# EAGLE design shift_driver (EAGLE 8.3.2)
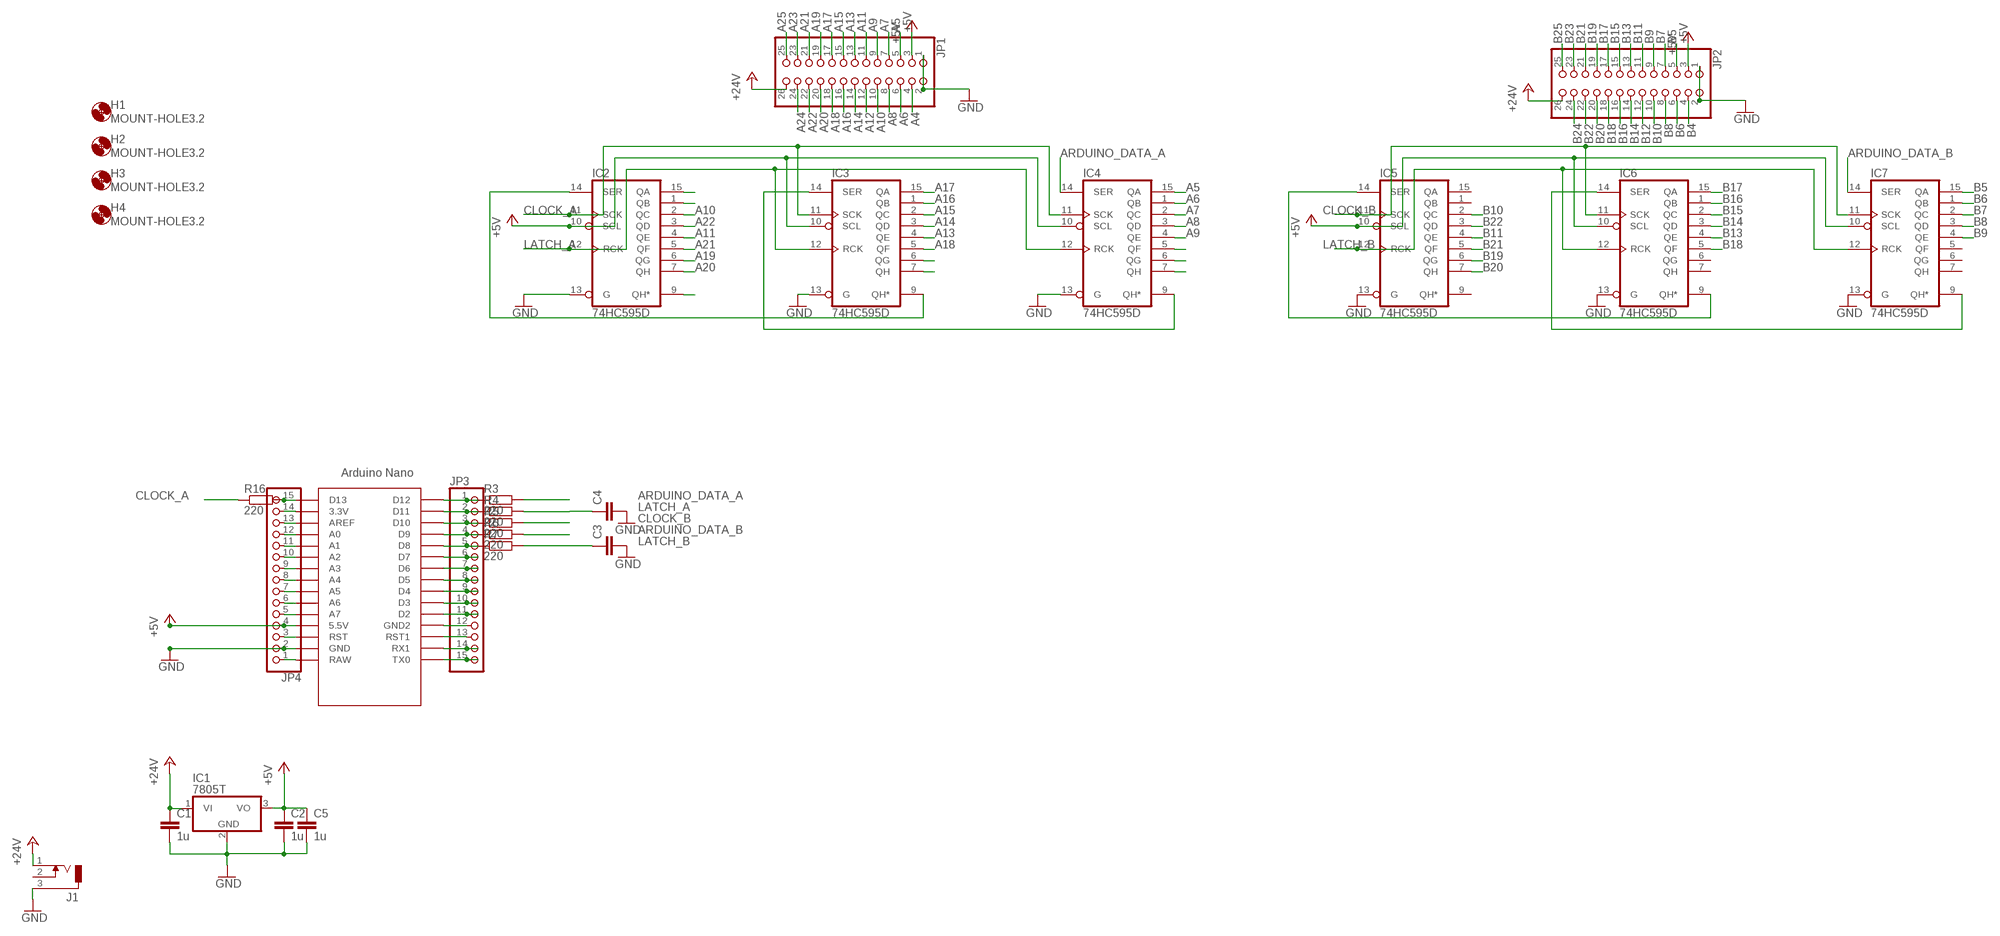
[diagram p0: schematic, sheet 1]

## Parts
C1  1u  C-EUC0805  [C0805]
C2  1u  C-EUC0805  [C0805]
C3  C-EUC0805  [C0805]
C4  C-EUC0805  [C0805]
C5  1u  C-EUC0805  [C0805]
H1  MOUNT-HOLE3.2  [3,2]
H2  MOUNT-HOLE3.2  [3,2]
H3  MOUNT-HOLE3.2  [3,2]
H4  MOUNT-HOLE3.2  [3,2]
IC1  7805T  [TO220H]
IC2  74HC595D  [SO16]
IC3  74HC595D  [SO16]
IC4  74HC595D  [SO16]
IC5  74HC595D  [SO16]
IC6  74HC595D  [SO16]
IC7  74HC595D  [SO16]
J1  DCJ0303  [DCJ0303]
JP1  PINHD-2X13  [2X13]
JP2  PINHD-2X13  [2X13]
JP3  PINHD-1X15  [1X15]
JP4  PINHD-1X15  [1X15]
R3  220  R-EU_R0603  [R0603]
R4  220  R-EU_R0603  [R0603]
R5  220  R-EU_R0603  [R0603]
R6  220  R-EU_R0603  [R0603]
R7  220  R-EU_R0603  [R0603]
R16  220  R-EU_R0603  [R0603]
U$1  NANO  [NANO]

## Nets
+5V: C2.1 C5.1 IC1.3(VO) IC2.10(SCL) IC3.10(SCL) IC4.10(SCL) IC5.10(SCL) IC6.10(SCL) IC7.10(SCL) JP1.3 JP2.3 JP4.4 U$1.5V(5.5V)
+24V: C1.1 IC1.1(VI) J1.1 JP1.26 JP2.26
A4: JP1.4
A5: IC4.15(QA) JP1.5
A6: IC4.1(QB) JP1.6
A7: IC4.2(QC) JP1.7
A8: IC4.3(QD) JP1.8
A9: IC4.4(QE) JP1.9
A10: IC2.2(QC) JP1.10
A11: IC2.4(QE) JP1.11
A12: JP1.12
A13: IC3.4(QE) JP1.13
A14: IC3.3(QD) JP1.14
A15: IC3.2(QC) JP1.15
A16: IC3.1(QB) JP1.16
A17: IC3.15(QA) JP1.17
A18: IC3.5(QF) JP1.18
A19: IC2.6(QG) JP1.19
A20: IC2.7(QH) JP1.20
A21: IC2.5(QF) JP1.21
A22: IC2.3(QD) JP1.22
A23: JP1.23
A24: JP1.24
A25: JP1.25
ARDUINO_DATA_A: IC4.14(SER) R3.2
ARDUINO_DATA_B: IC7.14(SER) R6.2
B4: JP2.4
B5: IC7.15(QA) JP2.5
B6: IC7.1(QB) JP2.6
B7: IC7.2(QC) JP2.7
B8: IC7.3(QD) JP2.8
B9: IC7.4(QE) JP2.9
B10: IC5.2(QC) JP2.10
B11: IC5.4(QE) JP2.11
B12: JP2.12
B13: IC6.4(QE) JP2.13
B14: IC6.3(QD) JP2.14
B15: IC6.2(QC) JP2.15
B16: IC6.1(QB) JP2.16
B17: IC6.15(QA) JP2.17
B18: IC6.5(QF) JP2.18
B19: IC5.6(QG) JP2.19
B20: IC5.7(QH) JP2.20
B21: IC5.5(QF) JP2.21
B22: IC5.3(QD) JP2.22
B23: JP2.23
B24: JP2.24
B25: JP2.25
CLOCK_A: IC2.11(SCK) IC3.11(SCK) IC4.11(SCK) R16.1
CLOCK_B: IC5.11(SCK) IC6.11(SCK) IC7.11(SCK) R5.2
GND: C1.2 C2.2 C3.2 C4.2 C5.2 IC1.2(GND) IC2.13(G) IC3.13(G) IC4.13(G) IC5.13(G) IC6.13(G) IC7.13(G) J1.3 JP1.1 JP1.2 JP2.1 JP2.2 JP4.2 U$1.GND
LATCH_A: C4.1 IC2.12(RCK) IC3.12(RCK) IC4.12(RCK) R4.2
LATCH_B: C3.1 IC5.12(RCK) IC6.12(RCK) IC7.12(RCK) R7.2
N$6: IC2.15(QA)
N$8: IC2.14(SER) IC3.9(QH*)
N$9: JP3.12 U$1.GND1(GND2)
N$12: JP3.13 U$1.RST1
N$13: IC2.1(QB)
N$14: IC3.14(SER) IC4.9(QH*)
N$15: JP4.1 U$1.RAW
N$16: JP4.3 U$1.RST
N$25: JP4.13 U$1.AREF
N$26: JP4.14 U$1.3.3V
N$32: JP3.15 U$1.TX0
N$33: JP3.14 U$1.RX1
N$34: JP3.11 U$1.D2
N$35: JP3.10 U$1.D3
N$36: JP3.9 U$1.D4
N$37: JP3.8 U$1.D5
N$38: JP3.7 U$1.D6
N$39: JP3.6 U$1.D7
N$40: JP3.5 R7.1 U$1.D8
N$41: JP3.4 R6.1 U$1.D9
N$42: JP3.3 R5.1 U$1.D10
N$43: JP3.2 R4.1 U$1.D11
N$44: JP3.1 R3.1 U$1.D12
N$46: JP4.15 R16.2 U$1.D13
N$47: JP4.12 U$1.A0
N$48: JP4.11 U$1.A1
N$49: JP4.10 U$1.A2
N$50: JP4.9 U$1.A3
N$51: JP4.8 U$1.A4
N$52: JP4.7 U$1.A5
N$53: JP4.6 U$1.A6
N$54: JP4.5 U$1.A7
N$57: IC2.9(QH*)
N$64: IC3.6(QG)
N$65: IC3.7(QH)
N$71: IC4.5(QF)
N$72: IC4.6(QG)
N$73: IC4.7(QH)
N$77: IC5.14(SER) IC6.9(QH*)
N$78: IC6.14(SER) IC7.9(QH*)
Unconnected: IC5.1(QB) IC5.9(QH*) IC5.15(QA) IC6.6(QG) IC6.7(QH) IC7.5(QF) IC7.6(QG) IC7.7(QH) J1.2 U$1.ICSP1 U$1.ICSP2 U$1.ICSP3 U$1.ICSP4 U$1.ICSP5 U$1.ICSP6

## Power pins joined to a net without a drawn wire
GND: IC2.8(GND) IC3.8(GND) IC4.8(GND) IC5.8(GND) IC6.8(GND) IC7.8(GND)
VCC: IC2.16(VCC) IC3.16(VCC) IC4.16(VCC) IC5.16(VCC) IC6.16(VCC) IC7.16(VCC)

## Library data of the parts
C1-C5 = rcl:C-EU: CAPACITOR, European symbol
H1-H4 = holes:MOUNT-HOLE: MOUNTING HOLE with drill center marker
IC1 = linear:78*: Positive VOLTAGE REGULATOR Source: http://cache.national.com/ds/LM/LM78L05.pdf http://www.fairchildsemi.com/ds/LM/LM7805.pdf
IC2-IC7 = 74xx-eu:74*595: 8-bit SHIFT REGISTER, output latch
J1 = AH_components:DCJ0303: DC POWER JACK Source: DCJ0303.pdf; OC_FARNELL: unknown; OC_NEWARK: unknown
JP1 JP2 = pinhead:PINHD-2X13: PIN HEADER
JP3 JP4 = pinhead:PINHD-1X15: PIN HEADER
R3-R7 R16 = rcl:R-EU_: RESISTOR, European symbol
U$1 = Arduino-clone:NANO: Arduino Nano

## Net classes
0 default: clearance 0.205 mm

## Board
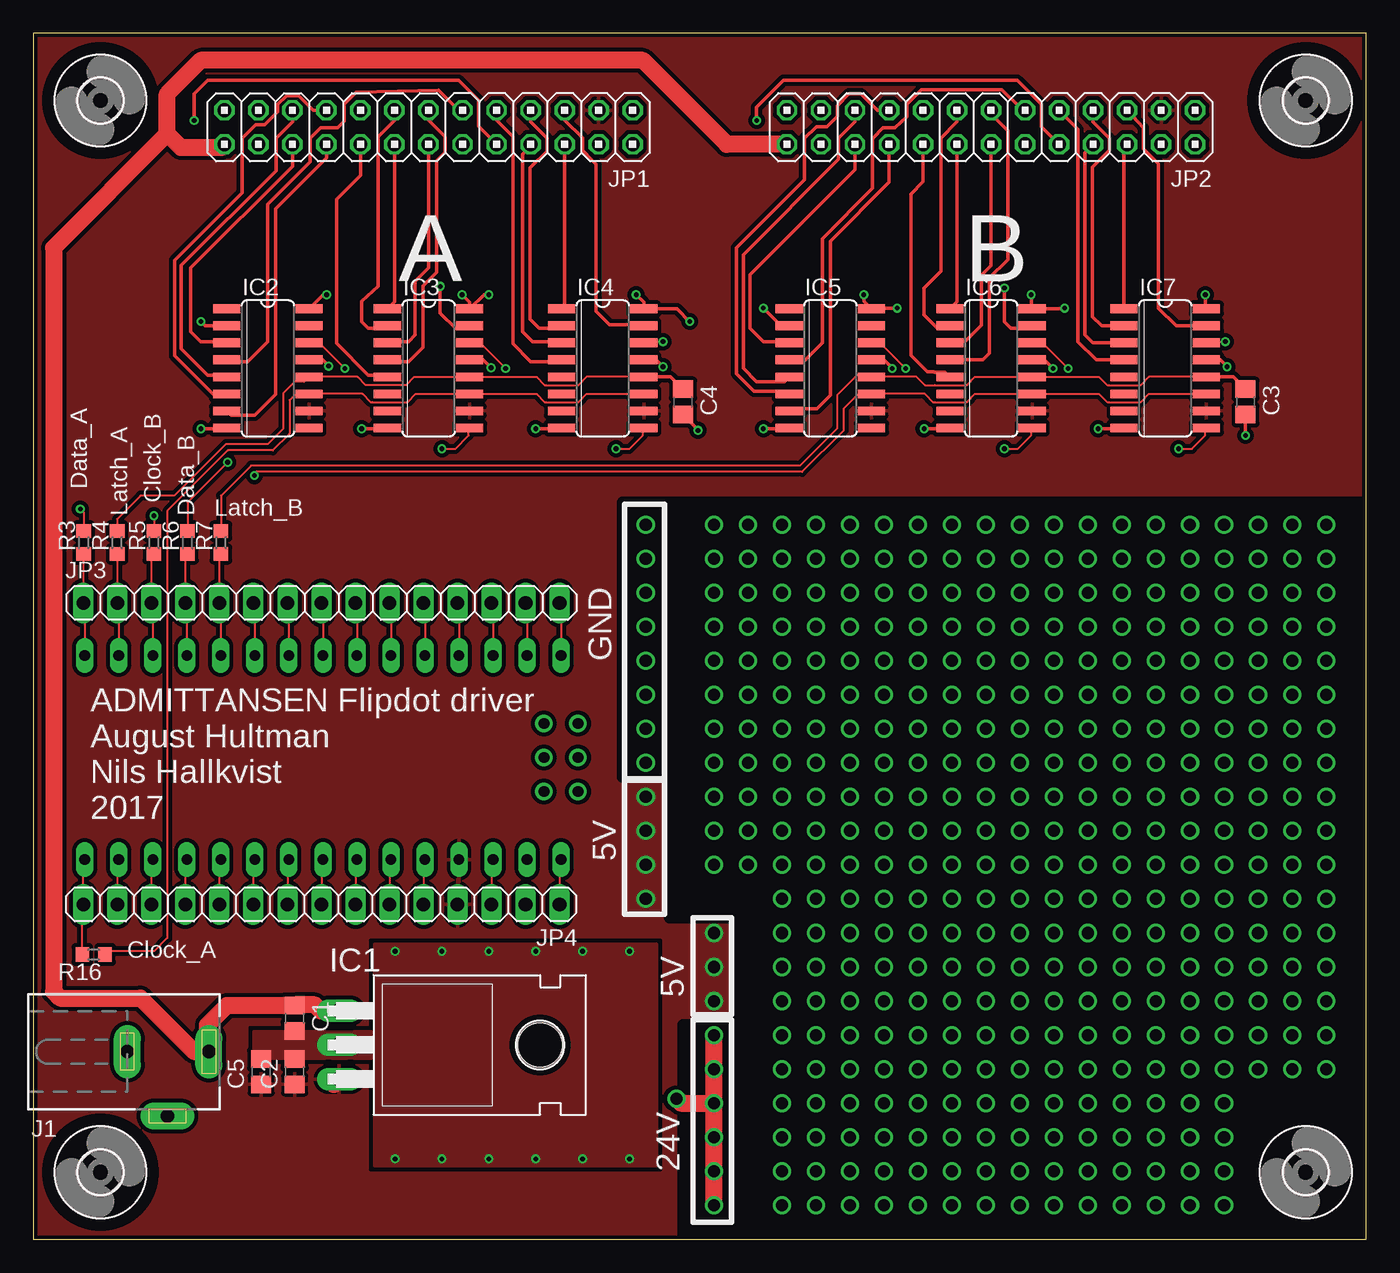
[diagram p1: board, top side]
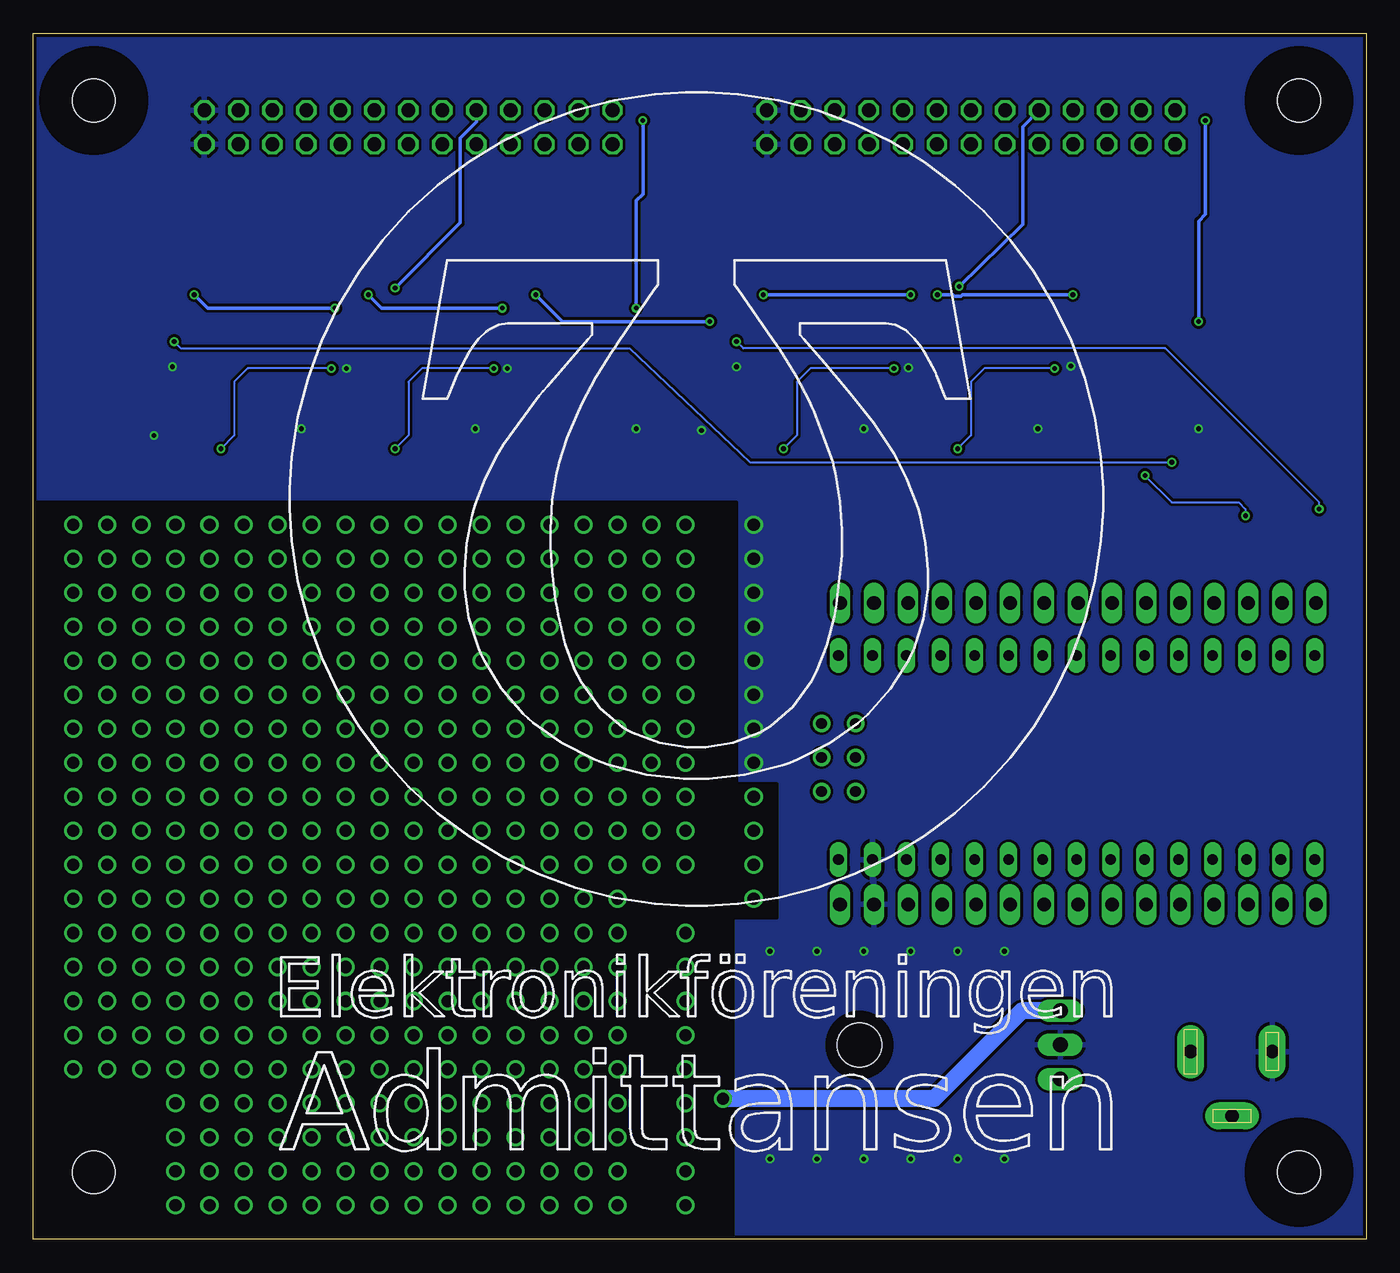
[diagram p2: board, bottom side, seen from below]

Size 99.5 x 90 mm. Coordinates in mm from the lower left corner, seen from the top.
Outline: 0,0 99.5,0 99.5,90 0,90 0,0
Copper layers (1*16): Top 0.035mm / dielectric 1.5mm / Bottom 0.035mm
Design rules "SeeedStudio_2layer_DRU_no_angle_20140221 *": minimum track width 6mil, minimum drill 12mil, track to track 6mil, track to pad 6mil, pad to pad 6mil, via to via 6mil, smd to smd 0mil, copper to edge 10mil, drill to drill 10mil, minimum pad ring 10mil, minimum via ring 6mil, stop-mask expansion 2mil, vias tented up to drill 100mil, thermal gap 10mil
tRestrict: area 44,0 to 99.5,55
bRestrict: area 44,0 to 99.5,55

### Footprints (pad centres in the part's own frame; a part is rotated, then mirrored left to right if it is on the bottom)
C0805 = smd 1.3 x 1.5: 1 -0.95,0; 2 0.95,0
3,2 = hole 3.2: 0,0
TO220H = drill 1.118 long: 1 -2.54,-10.16; 2 0,-10.16; 3 2.54,-10.16 | hole 3.302: 0,4.826
SO16 = smd 0.66 x 2.032: 1 -4.445,-3.073; 2 -3.175,-3.073; 3 -1.905,-3.073; 4 -0.635,-3.073; 5 0.635,-3.073; 6 1.905,-3.073; 7 3.175,-3.073; 8 4.445,-3.073; 9 4.445,3.073; 10 3.175,3.073; 11 1.905,3.073; 12 0.635,3.073; 13 -0.635,3.073; 14 -1.905,3.073; 15 -3.175,3.073; 16 -4.445,3.073
DCJ0303 = drill 1 pad 2 long: 1 0,3.1; 2 4.8,0; 3 0,-3
2X13 = drill 1.016 octagon: 1 -15.24,-1.27; 2 -15.24,1.27; 3 -12.7,-1.27; 4 -12.7,1.27; 5 -10.16,-1.27; 6 -10.16,1.27; 7 -7.62,-1.27; 8 -7.62,1.27; 9 -5.08,-1.27; 10 -5.08,1.27; 11 -2.54,-1.27; 12 -2.54,1.27; 13 0,-1.27; 14 0,1.27; 15 2.54,-1.27; 16 2.54,1.27; 17 5.08,-1.27; 18 5.08,1.27; 19 7.62,-1.27; 20 7.62,1.27; 21 10.16,-1.27; 22 10.16,1.27; 23 12.7,-1.27; 24 12.7,1.27; 25 15.24,-1.27; 26 15.24,1.27
1X15 = drill 1.016 long: 1 -17.78,0; 2 -15.24,0; 3 -12.7,0; 4 -10.16,0; 5 -7.62,0; 6 -5.08,0; 7 -2.54,0; 8 0,0; 9 2.54,0; 10 5.08,0; 11 7.62,0; 12 10.16,0; 13 12.7,0; 14 15.24,0; 15 17.78,0
R0603 = smd 1 x 1.1: 1 -0.85,0; 2 0.85,0
NANO = drill 0.8 long: 3.3V -10.16,24.13; 5V -10.16,-1.27; A0 -10.16,19.05; A1 -10.16,16.51; A2 -10.16,13.97; A3 -10.16,11.43; A4 -10.16,8.89; A5 -10.16,6.35; A6 -10.16,3.81; A7 -10.16,1.27; AREF -10.16,21.59; D2 5.08,1.27; D3 5.08,3.81; D4 5.08,6.35; D5 5.08,8.89; D6 5.08,11.43; D7 5.08,13.97; D8 5.08,16.51; D9 5.08,19.05; D10 5.08,21.59; D11 5.08,24.13; D12 5.08,26.67; D13 -10.16,26.67; GND -10.16,-6.35; GND1 5.08,-1.27; RAW -10.16,-8.89; RST -10.16,-3.81; RST1 5.08,-3.81; RX1 5.08,-6.35; TX0 5.08,-8.89 | drill 0.8: ICSP1 -5.08,-10.16; ICSP2 -5.08,-7.62; ICSP3 -2.54,-10.16; ICSP4 -2.54,-7.62; ICSP5 0,-10.16; ICSP6 0,-7.62

### Placement (x,y rotation side)
C1  19.5,16.5 270 top
C2  19.5,12.5 90 top
C3  90.5,62.5 270 top
C4  48.5,62.5 270 top
C5  17,12.5 90 top
H1  5,5 0 top
H2  5,85 0 top
H3  95,5 0 top
H4  95,85 0 top
IC1  33,14.5 270 top
IC2  17.5,65 270 top
IC3  29.5,65 270 top
IC4  42.5,65 270 top
IC5  59.5,65 270 top
IC6  71.5,65 270 top
IC7  84.5,65 270 top
J1  10,14 270 top
JP1  29.5,83 180 top
JP2  71.5,83 180 top
JP3  21.5,47.5 0 top
JP4  21.5,25 180 top
R3  3.75,52 90 top
R4  6.25,52 90 top
R5  9,52 90 top
R6  11.5,52 90 top
R7  14,52 90 top
R16  4.5,21.25 180 top
U$1  30.5,38.5 90 top

### Tracks (layer width: path | path; a pad name or v marks a point on that pad's centre or on a via)
+5V  (via drill 0.9)
  Top 1.27: 22.43,11.55 IC1.3
  other vias: 50.8,17.78 50.8,20.32 50.8,22.86 45.72,25.4 45.72,27.94 45.72,30.48 45.72,33.02
  pour Top (isolate 0.3, rank 3): 0,90 99.5,90 99.5,0 0,0
+24V  (via drill 0.9)
  Top 1.27: IC1.1 21.46,17.04 21,17.5 19.55,17.5 C1.1 14.45,17.45 13,16 13,14.1 J1.1 12,14 8,18 2,18 1.5,18.5 1.5,74 10,82.5 | JP2.26 51.77,81.73 45.5,88 12.5,88 10,85.5 10,82.5 | 10,82.5 11,81.5 14.03,81.5 JP1.26 | v48,10.5 48.34,10.16 v50.8,10.16 | v50.8,2.54 v50.8,5.08 v50.8,7.62 v50.8,10.16 | v50.8,10.16 v50.8,12.7 v50.8,15.24
  Bottom 1.27: IC1.1 25.71,17.04 32.25,10.5 v48,10.5
A5
  Top 0.254: JP1.5 39.66,83.53 40.98,82.2 40.98,81.28 41.75,80.51 41.86,80.39 42,80.25 42,69.25 43,68.25 45.5,68.25 IC4.15
A6
  Top 0.254: JP1.6 39.66,69.68 IC4.1
A7
  Top 0.254: JP1.7 37.12,83.4 38.34,82.18 38.34,81.21 37.09,79.96 37.09,68.66 37.75,68 39.25,68 IC4.2
A8
  Top 0.254: JP1.8 37.12,81.62 36.5,81 36.5,67.75 37.25,67 39.33,67 IC4.3
A9
  Top 0.254: JP1.9 34.58,83.53 35.8,82.31 35.8,66.83 37.12,65.5 39.29,65.5 IC4.4
A10  (via drill 0.35)
  Top 0.254: IC2.2 12.82,68.17 v12.5,68.5 | v12,83.5 12,85.5 13,86.5 31.75,86.5 33.25,85 33.25,83.06 JP1.10
  Bottom 0.254: v12.5,68.5 12.5,76 12,76.5 v12,83.5
A11
  Top 0.254: JP1.11 31.73,84.27 30.25,85.75 24.11,85.62 23.2,84.72 23.2,83.45 22.7,82.95 21.43,82.95 20.66,82.18 20.66,80.41 17.5,77.25 17.5,67 16,65.5 14.56,65.5 IC2.4
A13
  Top 0.254: JP1.13 29.5,83.53 30.72,82.31 30.72,81.15 30.08,80.52 30.08,72.19 29.08,71.19 29.08,66.58 28,65.5 26.56,65.5 IC3.4
A14
  Top 0.254: JP1.14 29.5,72.5 28.5,71.5 28.5,67.5 28,67 26.52,67 IC3.3
A15
  Top 0.254: JP1.15 26.96,83.53 25.74,82.31 25.74,71.12 24.5,70 24.5,68.5 25,68 26.25,68 IC3.2
A16
  Top 0.254: JP1.16 26.96,69.98 IC3.1
A17  (via drill 0.35)
  Top 0.254: IC3.15 32.4,68 31.5,68 30.38,69.12 v30.38,71.12
  Bottom 0.254: JP1.17 25.64,83.05 25.64,81.15 25.62,81.02 25.62,75.75 v30.38,71.12
A18
  Top 0.254: JP1.18 24.42,79.42 22.62,77.62 22.62,66.88 25,64.5 25.75,64.5 25.77,64.47 26.32,64.47 IC3.5
A19
  Top 0.254: 16.35,82.95 16.26,82.86 | 16.26,82.86 15.58,82.18 15.58,78.13 10.54,73.09 10.54,65.96 13.5,63 14.33,63 IC2.6 | 16.26,82.86 16.58,83.18 17.25,83.18 18.25,84.17 18.25,84.72 18.89,85.36 19.79,85.36 20.89,84.27 JP1.19
A20
  Top 0.254: JP1.20 21.88,80.73 18.07,76.93 18.07,63.07 16.5,61.5 14.75,61.5 IC2.7
A21
  Top 0.254: JP1.21 19.34,83.4 18.12,82.18 18.12,79.77 11.04,72.69 11.04,66.46 13,64.5 14.29,64.5 IC2.5
A22
  Top 0.254: JP1.22 19.34,80.09 11.75,72.5 11.75,67.75 12.5,67 14.33,67 IC2.3
ARDUINO_DATA_A  (via drill 0.35)
  Top 0.152: IC4.14 45.67,67 v47,67 | v3.5,54.5 3.75,54.25 R3.2
  Bottom 0.152: v47,67 46.5,66.5 15,66.5 3.5,55 v3.5,54.5
ARDUINO_DATA_B  (via drill 0.35)
  Top 0.152: IC7.14 87.67,67 v89,67 | v14.5,58 11.5,55 R6.2
  Bottom 0.152: v89,67 88.5,66.5 55,66.5 46,58 v14.5,58
B5
  Top 0.254: JP2.5 82.86,82.95 82.86,81.4 84,80.26 84,69.5 85.33,68.17 IC7.15
B6
  Top 0.254: JP2.6 81.43,81.5 IC7.1
B7
  Top 0.254: JP2.7 79.12,83.4 80.34,82.18 80.34,81.28 79.08,80.02 79.08,68.88 79.78,68.17 IC7.2
B8
  Top 0.254: JP2.8 78.5,81.11 78.5,67.5 79.09,66.91 IC7.3
B9
  Top 0.254: JP2.9 78,82.85 78,67 79.36,65.64 IC7.4
B10  (via drill 0.35)
  Top 0.254: JP2.10 75.26,83.05 75.26,84.72 73.48,86.5 56,86.5 54,84.5 v54,83.5 | v54.5,69.5 55.83,68.17 IC5.2
  Bottom 0.254: v54,83.5 54,78 54.5,77.5 v54.5,69.5
B11
  Top 0.254: 62.66,82.06 62.68,82.2 | 62.68,82.2 63.43,82.95 64.33,82.95 65.2,83.8 65.2,84.72 66.3,85.82 72.33,85.82 73.88,84.27 JP2.11 | 62.68,82.2 62.66,82.06 | 62.66,82.06 62.66,78.43 58.92,74.69 58.92,66.92 57.5,65.5 56.56,65.5 IC5.4
B13
  Top 0.254: JP2.13 71.5,84 72.75,82.75 72.75,73.12 71.38,71.75 71.38,66.12 70.89,65.64 IC6.4
B14
  Top 0.254: IC6.3 68.54,67.02 69.58,67.02 70.79,68.23 70.79,71.94 71.5,72.65 JP2.14
B15
  Top 0.254: JP2.15 68.96,83.4 67.74,82.18 67.74,72.24 66.5,71 66.5,69 67.5,68 68.25,68 IC6.2
B16
  Top 0.254: JP2.16 68.96,69.98 IC6.1
B17  (via drill 0.35)
  Top 0.254: IC6.15 74.4,68 73,68 72.5,68.5 v72.5,71
  Bottom 0.254: JP2.17 66.42,83.4 67.64,82.18 67.64,75.86 v72.5,71
B18
  Top 0.254: JP2.18 66.42,78.92 65.5,78 65.5,66 66.75,64.75 67.25,64.75 67.27,64.72 68.07,64.72 IC6.5
B19
  Top 0.254: JP2.19 63.01,84.27 61.79,85.49 60.89,85.49 60.02,84.62 60.02,83.82 59.25,83.05 58.45,83.05 57.58,82.18 57.58,79.08 52.5,74 52.5,64.6 53.81,63.29 56.23,63.29 IC5.6
B20
  Top 0.254: IC5.7 56.6,62 58.5,62 59.5,63 59.5,74.5 | JP2.20 63.88,78.88 59.5,74.5 | 59.5,74.5
B21
  Top 0.254: JP2.21 61.34,83.4 60.12,82.18 60.12,80.62 53,73.5 53,65 54,64 56.06,64 IC5.5
B22
  Top 0.254: JP2.22 61.34,79.84 53.5,72 53.5,68 54.5,67 56.33,67 IC5.3
CLOCK_A
  Top 0.152: IC4.11 41.29,63.09 40.68,62.48 40.56,62.48 38.29,62.48 38.17,62.48 37.56,63.09 IC3.11 28.54,63.09 27.93,62.48 27.56,62.48 25.29,62.48 25.17,62.48 24.56,63.09 IC2.11 20.48,63 19.5,63 19.12,62.62 19.12,60.12 17.88,58.88 14.5,58.88 10,54.38 10,22.5 9,21.5 5.6,21.5 R16.1
CLOCK_B  (via drill 0.35)
  Top 0.152: IC7.11 83.29,63.09 82.68,62.48 82.56,62.48 80.29,62.48 80.17,62.48 79.56,63.09 IC6.11 70.29,63.09 69.68,62.48 69.56,62.48 67.29,62.48 67.17,62.48 66.56,63.09 IC5.11 62.48,63 61.5,63 60.48,61.98 60.48,60.35 57.4,57.27 16.62,57.27 16.5,57.14 v16.5,57 | v9,54 R5.2
  Bottom 0.152: v16.5,57 14.5,55 9.5,55 9,54.5 v9,54
GND  (via drill 0.35, 0.9)
  Top 0.254: IC5.13 63.49,65.64 v64.12,65 | IC6.13 75.49,65.64 v76.12,65 | IC7.13 88.61,65.64 v89.12,65.12 | IC2.13 21.58,65.64 v22.04,65.17 | IC3.13 33.58,65.64 v34.17,65.05 | IC4.13 46.49,65.64 v47,65.12 | IC4.8 39.37,60.5 v37.5,60.5 | IC3.8 26.37,60.5 v24.5,60.5 | IC2.8 14.37,60.5 v12.5,60.5 | IC5.8 56.37,60.5 v54.5,60.5 | IC6.8 68.37,60.5 v66.5,60.5 | IC7.8 81.37,60.5 v79.5,60.5 | C3.2 v90.5,60 | C4.2 49.5,60.55 v49.62,60.38
  other vias: 27,21.5 30.5,21.5 34,21.5 37.5,21.5 41,21.5 44.5,21.5 27,6 30.5,6 34,6 37.5,6 41,6 44.5,6 45.72,53.34 45.72,50.8 45.72,48.26 45.72,45.72 45.72,43.18 45.72,40.64 45.72,38.1 45.72,35.56
  pour Bottom (isolate 0.6, rank 2): 0,90 0,0 99.5,0 99.5,90
  pour Top (isolate 0.61, rank 2, no thermals): 46.5,22 46.5,5.5 25.5,5.5 25.5,13.5 16.5,13.5 16.5,15.5 25.5,15.5 25.5,22
  pour Bottom: 0,0 0,90 99.5,90 99.5,0
LATCH_A
  Top 0.152: IC4.12 41.29,64.36 40.68,63.76 40.56,63.76 40.56,63.75 38.29,63.75 38.29,63.76 38.17,63.76 37.56,64.36 IC3.12 28.42,64.36 27.81,63.76 27.56,63.76 27.56,63.75 25.29,63.75 25.29,63.76 24.8,63.76 24.18,64.36 IC2.12 20.21,64 19.5,64 18.64,63.14 18.64,60.5 17.5,59.36 14.35,59.36 10.5,55.5 8,55.5 6.25,53.75 R4.2
  Top 0.254: C4.1 47.59,64.36 IC4.12
LATCH_B
  Top 0.152: IC7.12 87.5,64.36 83.29,64.36 82.68,63.76 82.56,63.76 82.56,63.75 80.29,63.75 80.29,63.76 80.17,63.76 79.56,64.36 IC6.12 70.29,64.36 69.68,63.76 69.56,63.76 69.56,63.75 67.29,63.75 67.29,63.76 66.55,63.76 65.94,64.36 IC5.12 62.44,64.5 61.5,64.5 60,63 60,60.5 57.25,57.75 16.25,57.75 14,55.5 R7.2
  Top 0.254: C3.1 89.58,64.36 87.5,64.36
N$1  (via drill 0.9)
  other vias: 50.8,53.34
N$8  (via drill 0.35)
  Top 0.152: IC2.14 21.34,66.91 v23.25,65 | v30.5,59 31.5,59 32.5,60 32.5,60.48 IC3.9
  Bottom 0.152: v23.25,65 28.5,65 29.5,64 29.5,60 v30.5,59
N$9
  Top 0.152: JP3.12 31.77,47.39 U$1.GND1
N$12
  Top 0.152: JP3.13 34.31,47.39 U$1.RST1
N$14  (via drill 0.35)
  Top 0.152: IC3.14 33.34,66.91 v35.25,65 | v43.5,59 44.5,59 45.5,60 45.5,60.48 IC4.9
  Bottom 0.152: v35.25,65 41.5,65 42.5,64 42.5,60 v43.5,59
N$15
  Top 0.152: U$1.RAW 39.28,28.23 JP4.1
N$16
  Top 0.152: U$1.RST 34.2,28.23 JP4.3
N$25
  Top 0.152: U$1.AREF 8.8,28.23 JP4.13
N$26
  Top 0.152: U$1.3.3V 6.26,28.23 JP4.14
N$32
  Top 0.152: JP3.15 39.39,47.39 U$1.TX0
N$33
  Top 0.152: JP3.14 36.85,47.39 U$1.RX1
N$34
  Top 0.152: JP3.11 29.23,47.39 U$1.D2
N$35
  Top 0.152: JP3.10 26.69,47.39 U$1.D3
N$36
  Top 0.152: JP3.9 24.15,47.39 U$1.D4
N$37
  Top 0.152: JP3.8 21.61,47.39 U$1.D5
N$38
  Top 0.152: JP3.7 19.07,47.39 U$1.D6
N$39
  Top 0.152: JP3.6 16.53,47.39 U$1.D7
N$40
  Top 0.152: R7.1 13.88,51.03 JP3.5 13.99,47.39 U$1.D8
N$41
  Top 0.152: R6.1 11.34,50.99 JP3.4 11.45,47.39 U$1.D9
N$42
  Top 0.152: R5.1 8.8,50.95 JP3.3 8.91,47.39 U$1.D10
N$43
  Top 0.152: R4.1 JP3.2 6.37,47.39 U$1.D11
N$44
  Top 0.152: R3.1 3.72,51.12 JP3.1 3.83,47.39 U$1.D12
N$46
  Top 0.152: U$1.D13 3.72,28.23 3.72,25.04 | 3.72,25.04 JP4.15 3.75,24.97 | R16.2 3.65,24.97 3.72,25.04
N$47
  Top 0.152: U$1.A0 11.34,28.23 JP4.12
N$48
  Top 0.152: U$1.A1 13.88,28.23 JP4.11
N$49
  Top 0.152: U$1.A2 16.42,28.23 JP4.10
N$50
  Top 0.152: U$1.A3 18.96,28.23 JP4.9
N$51
  Top 0.152: U$1.A4 21.5,28.23 JP4.8
N$52
  Top 0.152: U$1.A5 24.04,28.23 JP4.7
N$53
  Top 0.152: U$1.A6 26.58,28.23 JP4.6
N$54
  Top 0.152: U$1.A7 29.12,28.23 JP4.5
N$59  (via drill 0.9)
  other vias: 50.8,50.8
N$60  (via drill 0.9)
  other vias: 50.8,48.26
N$61  (via drill 0.9)
  other vias: 50.8,45.72
N$62  (via drill 0.9)
  other vias: 50.8,43.18
N$63  (via drill 0.9)
  other vias: 50.8,40.64
N$66  (via drill 0.9)
  other vias: 50.8,38.1
N$67  (via drill 0.9)
  other vias: 50.8,35.56
N$68  (via drill 0.9)
  other vias: 50.8,33.02
N$69  (via drill 0.9)
  other vias: 50.8,30.48
N$70  (via drill 0.9)
  other vias: 50.8,27.94
N$76  (via drill 0.9)
  other vias: 53.34,27.94
N$77  (via drill 0.35)
  Top 0.152: IC5.14 63.22,66.91 v65.12,65 | v72.5,59 73.5,59 74.5,60 74.5,60.48 IC6.9
  Bottom 0.152: v65.12,65 70.5,65 71.5,64 71.5,60 v72.5,59
N$78  (via drill 0.35)
  Top 0.152: IC6.14 75.34,66.91 v77.25,65 | v85.5,59 86.5,59 87.5,60 87.5,60.48 IC7.9
  Bottom 0.152: v77.25,65 83.5,65 84.5,64 84.5,60 v85.5,59
N$79  (via drill 0.9)
  other vias: 53.34,30.48
N$80  (via drill 0.9)
  other vias: 53.34,33.02
N$81  (via drill 0.9)
  other vias: 53.34,35.56
N$82  (via drill 0.9)
  other vias: 53.34,38.1
N$83  (via drill 0.9)
  other vias: 53.34,40.64
N$84  (via drill 0.9)
  other vias: 53.34,43.18
N$85  (via drill 0.9)
  other vias: 53.34,45.72
N$86  (via drill 0.9)
  other vias: 53.34,48.26
N$87  (via drill 0.9)
  other vias: 53.34,50.8
N$88  (via drill 0.9)
  other vias: 53.34,53.34
N$89  (via drill 0.9)
  other vias: 55.88,53.34
N$90  (via drill 0.9)
  other vias: 55.88,50.8
N$91  (via drill 0.9)
  other vias: 55.88,48.26
N$92  (via drill 0.9)
  other vias: 55.88,45.72
N$93  (via drill 0.9)
  other vias: 55.88,43.18
N$94  (via drill 0.9)
  other vias: 55.88,40.64
N$95  (via drill 0.9)
  other vias: 55.88,38.1
N$96  (via drill 0.9)
  other vias: 55.88,35.56
N$97  (via drill 0.9)
  other vias: 55.88,33.02
N$98  (via drill 0.9)
  other vias: 55.88,30.48
N$99  (via drill 0.9)
  other vias: 55.88,27.94
N$100  (via drill 0.9)
  other vias: 55.88,25.4
N$101  (via drill 0.9)
  other vias: 58.42,25.4
N$102  (via drill 0.9)
  other vias: 58.42,27.94
N$103  (via drill 0.9)
  other vias: 58.42,30.48
N$104  (via drill 0.9)
  other vias: 58.42,33.02
N$105  (via drill 0.9)
  other vias: 58.42,35.56
N$106  (via drill 0.9)
  other vias: 58.42,38.1
N$107  (via drill 0.9)
  other vias: 58.42,40.64
N$108  (via drill 0.9)
  other vias: 58.42,43.18
N$109  (via drill 0.9)
  other vias: 58.42,45.72
N$110  (via drill 0.9)
  other vias: 58.42,48.26
N$111  (via drill 0.9)
  other vias: 58.42,50.8
N$112  (via drill 0.9)
  other vias: 58.42,53.34
N$113  (via drill 0.9)
  other vias: 60.96,53.34
N$114  (via drill 0.9)
  other vias: 60.96,50.8
N$115  (via drill 0.9)
  other vias: 60.96,48.26
N$116  (via drill 0.9)
  other vias: 60.96,45.72
N$117  (via drill 0.9)
  other vias: 60.96,43.18
N$118  (via drill 0.9)
  other vias: 60.96,40.64
N$119  (via drill 0.9)
  other vias: 60.96,38.1
N$120  (via drill 0.9)
  other vias: 60.96,35.56
N$121  (via drill 0.9)
  other vias: 60.96,33.02
N$122  (via drill 0.9)
  other vias: 60.96,30.48
N$123  (via drill 0.9)
  other vias: 60.96,27.94
N$124  (via drill 0.9)
  other vias: 60.96,25.4
N$125  (via drill 0.9)
  other vias: 63.5,25.4
N$126  (via drill 0.9)
  other vias: 63.5,27.94
N$127  (via drill 0.9)
  other vias: 63.5,30.48
N$128  (via drill 0.9)
  other vias: 63.5,33.02
N$129  (via drill 0.9)
  other vias: 63.5,35.56
N$130  (via drill 0.9)
  other vias: 63.5,38.1
N$131  (via drill 0.9)
  other vias: 63.5,40.64
N$132  (via drill 0.9)
  other vias: 63.5,43.18
N$133  (via drill 0.9)
  other vias: 63.5,45.72
N$134  (via drill 0.9)
  other vias: 63.5,48.26
N$135  (via drill 0.9)
  other vias: 63.5,50.8
N$136  (via drill 0.9)
  other vias: 63.5,53.34
N$137  (via drill 0.9)
  other vias: 66.04,53.34
N$138  (via drill 0.9)
  other vias: 66.04,50.8
N$139  (via drill 0.9)
  other vias: 66.04,48.26
N$140  (via drill 0.9)
  other vias: 66.04,45.72
N$141  (via drill 0.9)
  other vias: 66.04,43.18
N$142  (via drill 0.9)
  other vias: 66.04,40.64
N$143  (via drill 0.9)
  other vias: 66.04,38.1
N$144  (via drill 0.9)
  other vias: 66.04,35.56
N$145  (via drill 0.9)
  other vias: 66.04,33.02
N$146  (via drill 0.9)
  other vias: 66.04,30.48
N$147  (via drill 0.9)
  other vias: 66.04,27.94
N$148  (via drill 0.9)
  other vias: 66.04,25.4
N$149  (via drill 0.9)
  other vias: 68.58,25.4
N$150  (via drill 0.9)
  other vias: 68.58,27.94
N$151  (via drill 0.9)
  other vias: 68.58,30.48
N$152  (via drill 0.9)
  other vias: 68.58,33.02
N$153  (via drill 0.9)
  other vias: 68.58,35.56
N$154  (via drill 0.9)
  other vias: 68.58,38.1
N$155  (via drill 0.9)
  other vias: 68.58,40.64
N$156  (via drill 0.9)
  other vias: 68.58,43.18
N$157  (via drill 0.9)
  other vias: 68.58,45.72
N$158  (via drill 0.9)
  other vias: 68.58,48.26
N$159  (via drill 0.9)
  other vias: 68.58,50.8
N$160  (via drill 0.9)
  other vias: 68.58,53.34
N$161  (via drill 0.9)
  other vias: 71.12,53.34
N$162  (via drill 0.9)
  other vias: 71.12,50.8
N$163  (via drill 0.9)
  other vias: 71.12,48.26
N$164  (via drill 0.9)
  other vias: 71.12,45.72
N$165  (via drill 0.9)
  other vias: 71.12,43.18
N$166  (via drill 0.9)
  other vias: 71.12,40.64
N$167  (via drill 0.9)
  other vias: 71.12,38.1
N$168  (via drill 0.9)
  other vias: 71.12,35.56
N$169  (via drill 0.9)
  other vias: 71.12,33.02
N$170  (via drill 0.9)
  other vias: 71.12,30.48
N$171  (via drill 0.9)
  other vias: 71.12,27.94
N$172  (via drill 0.9)
  other vias: 71.12,25.4
N$173  (via drill 0.9)
  other vias: 73.66,25.4
N$174  (via drill 0.9)
  other vias: 73.66,27.94
N$175  (via drill 0.9)
  other vias: 73.66,30.48
N$176  (via drill 0.9)
  other vias: 73.66,33.02
N$177  (via drill 0.9)
  other vias: 73.66,35.56
N$178  (via drill 0.9)
  other vias: 73.66,38.1
N$179  (via drill 0.9)
  other vias: 73.66,40.64
N$180  (via drill 0.9)
  other vias: 73.66,43.18
N$181  (via drill 0.9)
  other vias: 73.66,45.72
N$182  (via drill 0.9)
  other vias: 73.66,48.26
N$183  (via drill 0.9)
  other vias: 73.66,50.8
N$184  (via drill 0.9)
  other vias: 73.66,53.34
N$185  (via drill 0.9)
  other vias: 76.2,53.34
N$186  (via drill 0.9)
  other vias: 76.2,50.8
N$187  (via drill 0.9)
  other vias: 76.2,48.26
N$188  (via drill 0.9)
  other vias: 76.2,45.72
N$189  (via drill 0.9)
  other vias: 76.2,43.18
N$190  (via drill 0.9)
  other vias: 76.2,40.64
N$191  (via drill 0.9)
  other vias: 76.2,38.1
N$192  (via drill 0.9)
  other vias: 76.2,35.56
N$193  (via drill 0.9)
  other vias: 76.2,33.02
N$194  (via drill 0.9)
  other vias: 76.2,30.48
N$195  (via drill 0.9)
  other vias: 76.2,27.94
N$196  (via drill 0.9)
  other vias: 76.2,25.4
N$197  (via drill 0.9)
  other vias: 78.74,25.4
N$198  (via drill 0.9)
  other vias: 78.74,27.94
N$199  (via drill 0.9)
  other vias: 78.74,30.48
N$200  (via drill 0.9)
  other vias: 78.74,33.02
N$201  (via drill 0.9)
  other vias: 78.74,35.56
N$202  (via drill 0.9)
  other vias: 78.74,38.1
N$203  (via drill 0.9)
  other vias: 78.74,40.64
N$204  (via drill 0.9)
  other vias: 78.74,43.18
N$205  (via drill 0.9)
  other vias: 78.74,45.72
N$206  (via drill 0.9)
  other vias: 78.74,48.26
N$207  (via drill 0.9)
  other vias: 78.74,50.8
N$208  (via drill 0.9)
  other vias: 78.74,53.34
N$209  (via drill 0.9)
  other vias: 81.28,53.34
N$210  (via drill 0.9)
  other vias: 81.28,50.8
N$211  (via drill 0.9)
  other vias: 81.28,48.26
N$212  (via drill 0.9)
  other vias: 81.28,45.72
N$213  (via drill 0.9)
  other vias: 81.28,43.18
N$214  (via drill 0.9)
  other vias: 81.28,40.64
N$215  (via drill 0.9)
  other vias: 81.28,38.1
N$216  (via drill 0.9)
  other vias: 81.28,35.56
N$217  (via drill 0.9)
  other vias: 81.28,33.02
N$218  (via drill 0.9)
  other vias: 81.28,30.48
N$219  (via drill 0.9)
  other vias: 81.28,27.94
N$220  (via drill 0.9)
  other vias: 81.28,25.4
N$221  (via drill 0.9)
  other vias: 83.82,25.4
N$222  (via drill 0.9)
  other vias: 83.82,27.94
N$223  (via drill 0.9)
  other vias: 83.82,30.48
N$224  (via drill 0.9)
  other vias: 83.82,33.02
N$225  (via drill 0.9)
  other vias: 83.82,35.56
N$226  (via drill 0.9)
  other vias: 83.82,38.1
N$227  (via drill 0.9)
  other vias: 83.82,40.64
N$228  (via drill 0.9)
  other vias: 83.82,43.18
N$229  (via drill 0.9)
  other vias: 83.82,45.72
N$230  (via drill 0.9)
  other vias: 83.82,48.26
N$231  (via drill 0.9)
  other vias: 83.82,50.8
N$232  (via drill 0.9)
  other vias: 83.82,53.34
N$233  (via drill 0.9)
  other vias: 86.36,53.34
N$234  (via drill 0.9)
  other vias: 86.36,50.8
N$235  (via drill 0.9)
  other vias: 86.36,48.26
N$236  (via drill 0.9)
  other vias: 86.36,45.72
N$237  (via drill 0.9)
  other vias: 86.36,43.18
N$238  (via drill 0.9)
  other vias: 86.36,40.64
N$239  (via drill 0.9)
  other vias: 86.36,38.1
N$240  (via drill 0.9)
  other vias: 86.36,35.56
N$241  (via drill 0.9)
  other vias: 86.36,33.02
N$242  (via drill 0.9)
  other vias: 86.36,30.48
N$243  (via drill 0.9)
  other vias: 86.36,27.94
N$244  (via drill 0.9)
  other vias: 86.36,25.4
N$245  (via drill 0.9)
  other vias: 88.9,25.4
N$246  (via drill 0.9)
  other vias: 88.9,27.94
N$247  (via drill 0.9)
  other vias: 88.9,30.48
N$248  (via drill 0.9)
  other vias: 88.9,33.02
N$249  (via drill 0.9)
  other vias: 88.9,35.56
N$250  (via drill 0.9)
  other vias: 88.9,38.1
N$251  (via drill 0.9)
  other vias: 88.9,40.64
N$252  (via drill 0.9)
  other vias: 88.9,43.18
N$253  (via drill 0.9)
  other vias: 88.9,45.72
N$254  (via drill 0.9)
  other vias: 88.9,48.26
N$255  (via drill 0.9)
  other vias: 88.9,50.8
N$256  (via drill 0.9)
  other vias: 88.9,53.34
N$257  (via drill 0.9)
  other vias: 91.44,53.34
N$258  (via drill 0.9)
  other vias: 91.44,50.8
N$259  (via drill 0.9)
  other vias: 91.44,48.26
N$260  (via drill 0.9)
  other vias: 91.44,45.72
N$261  (via drill 0.9)
  other vias: 91.44,43.18
N$262  (via drill 0.9)
  other vias: 91.44,40.64
N$263  (via drill 0.9)
  other vias: 91.44,38.1
N$264  (via drill 0.9)
  other vias: 91.44,35.56
N$265  (via drill 0.9)
  other vias: 91.44,33.02
N$266  (via drill 0.9)
  other vias: 91.44,30.48
N$267  (via drill 0.9)
  other vias: 91.44,27.94
N$268  (via drill 0.9)
  other vias: 91.44,25.4
N$269  (via drill 0.9)
  other vias: 93.98,25.4
N$270  (via drill 0.9)
  other vias: 93.98,27.94
N$271  (via drill 0.9)
  other vias: 93.98,30.48
N$272  (via drill 0.9)
  other vias: 93.98,33.02
N$273  (via drill 0.9)
  other vias: 93.98,35.56
N$274  (via drill 0.9)
  other vias: 93.98,38.1
N$275  (via drill 0.9)
  other vias: 93.98,40.64
N$276  (via drill 0.9)
  other vias: 93.98,43.18
N$277  (via drill 0.9)
  other vias: 93.98,45.72
N$278  (via drill 0.9)
  other vias: 93.98,48.26
N$279  (via drill 0.9)
  other vias: 93.98,50.8
N$280  (via drill 0.9)
  other vias: 93.98,53.34
N$281  (via drill 0.9)
  other vias: 96.52,53.34
N$282  (via drill 0.9)
  other vias: 96.52,50.8
N$283  (via drill 0.9)
  other vias: 96.52,48.26
N$284  (via drill 0.9)
  other vias: 96.52,45.72
N$285  (via drill 0.9)
  other vias: 96.52,43.18
N$286  (via drill 0.9)
  other vias: 96.52,40.64
N$287  (via drill 0.9)
  other vias: 96.52,38.1
N$288  (via drill 0.9)
  other vias: 96.52,35.56
N$289  (via drill 0.9)
  other vias: 96.52,33.02
N$290  (via drill 0.9)
  other vias: 96.52,30.48
N$291  (via drill 0.9)
  other vias: 96.52,27.94
N$292  (via drill 0.9)
  other vias: 96.52,25.4
N$305  (via drill 0.9)
  other vias: 55.88,22.86
N$306  (via drill 0.9)
  other vias: 55.88,20.32
N$307  (via drill 0.9)
  other vias: 55.88,17.78
N$308  (via drill 0.9)
  other vias: 55.88,15.24
N$309  (via drill 0.9)
  other vias: 55.88,12.7
N$310  (via drill 0.9)
  other vias: 55.88,10.16
N$311  (via drill 0.9)
  other vias: 58.42,10.16
N$312  (via drill 0.9)
  other vias: 58.42,12.7
N$313  (via drill 0.9)
  other vias: 58.42,15.24
N$314  (via drill 0.9)
  other vias: 58.42,17.78
N$315  (via drill 0.9)
  other vias: 58.42,20.32
N$316  (via drill 0.9)
  other vias: 58.42,22.86
N$317  (via drill 0.9)
  other vias: 60.96,22.86
N$318  (via drill 0.9)
  other vias: 60.96,20.32
N$319  (via drill 0.9)
  other vias: 60.96,17.78
N$320  (via drill 0.9)
  other vias: 60.96,15.24
N$321  (via drill 0.9)
  other vias: 60.96,12.7
N$322  (via drill 0.9)
  other vias: 60.96,10.16
N$323  (via drill 0.9)
  other vias: 63.5,10.16
N$324  (via drill 0.9)
  other vias: 63.5,12.7
N$325  (via drill 0.9)
  other vias: 63.5,15.24
N$326  (via drill 0.9)
  other vias: 63.5,17.78
N$327  (via drill 0.9)
  other vias: 63.5,20.32
N$328  (via drill 0.9)
  other vias: 63.5,22.86
N$329  (via drill 0.9)
  other vias: 66.04,22.86
N$330  (via drill 0.9)
  other vias: 66.04,20.32
N$331  (via drill 0.9)
  other vias: 66.04,17.78
N$332  (via drill 0.9)
  other vias: 66.04,15.24
N$333  (via drill 0.9)
  other vias: 66.04,12.7
N$334  (via drill 0.9)
  other vias: 66.04,10.16
N$335  (via drill 0.9)
  other vias: 68.58,10.16
N$336  (via drill 0.9)
  other vias: 68.58,12.7
N$337  (via drill 0.9)
  other vias: 68.58,15.24
N$338  (via drill 0.9)
  other vias: 68.58,17.78
N$339  (via drill 0.9)
  other vias: 68.58,20.32
N$340  (via drill 0.9)
  other vias: 68.58,22.86
N$341  (via drill 0.9)
  other vias: 71.12,22.86
N$342  (via drill 0.9)
  other vias: 71.12,20.32
N$343  (via drill 0.9)
  other vias: 71.12,17.78
N$344  (via drill 0.9)
  other vias: 71.12,15.24
N$345  (via drill 0.9)
  other vias: 71.12,12.7
N$346  (via drill 0.9)
  other vias: 71.12,10.16
N$347  (via drill 0.9)
  other vias: 73.66,10.16
N$348  (via drill 0.9)
  other vias: 73.66,12.7
N$349  (via drill 0.9)
  other vias: 73.66,15.24
N$350  (via drill 0.9)
  other vias: 73.66,17.78
N$351  (via drill 0.9)
  other vias: 73.66,20.32
N$352  (via drill 0.9)
  other vias: 73.66,22.86
N$353  (via drill 0.9)
  other vias: 76.2,22.86
N$354  (via drill 0.9)
  other vias: 76.2,20.32
N$355  (via drill 0.9)
  other vias: 76.2,17.78
N$356  (via drill 0.9)
  other vias: 76.2,15.24
N$357  (via drill 0.9)
  other vias: 76.2,12.7
N$358  (via drill 0.9)
  other vias: 76.2,10.16
N$359  (via drill 0.9)
  other vias: 78.74,10.16
N$360  (via drill 0.9)
  other vias: 78.74,12.7
N$361  (via drill 0.9)
  other vias: 78.74,15.24
N$362  (via drill 0.9)
  other vias: 78.74,17.78
N$363  (via drill 0.9)
  other vias: 78.74,20.32
N$364  (via drill 0.9)
  other vias: 78.74,22.86
N$365  (via drill 0.9)
  other vias: 81.28,22.86
N$366  (via drill 0.9)
  other vias: 81.28,20.32
N$367  (via drill 0.9)
  other vias: 81.28,17.78
N$368  (via drill 0.9)
  other vias: 81.28,15.24
N$369  (via drill 0.9)
  other vias: 81.28,12.7
N$370  (via drill 0.9)
  other vias: 81.28,10.16
N$371  (via drill 0.9)
  other vias: 83.82,10.16
N$372  (via drill 0.9)
  other vias: 83.82,12.7
N$373  (via drill 0.9)
  other vias: 83.82,15.24
N$374  (via drill 0.9)
  other vias: 83.82,17.78
N$375  (via drill 0.9)
  other vias: 83.82,20.32
N$376  (via drill 0.9)
  other vias: 83.82,22.86
N$377  (via drill 0.9)
  other vias: 86.36,22.86
N$378  (via drill 0.9)
  other vias: 86.36,20.32
N$379  (via drill 0.9)
  other vias: 86.36,17.78
N$380  (via drill 0.9)
  other vias: 86.36,15.24
N$381  (via drill 0.9)
  other vias: 86.36,12.7
N$382  (via drill 0.9)
  other vias: 86.36,10.16
N$383  (via drill 0.9)
  other vias: 88.9,10.16
N$384  (via drill 0.9)
  other vias: 88.9,12.7
N$385  (via drill 0.9)
  other vias: 88.9,15.24
N$386  (via drill 0.9)
  other vias: 88.9,17.78
N$387  (via drill 0.9)
  other vias: 88.9,20.32
N$388  (via drill 0.9)
  other vias: 88.9,22.86
N$389  (via drill 0.9)
  other vias: 91.44,22.86
N$390  (via drill 0.9)
  other vias: 91.44,20.32
N$391  (via drill 0.9)
  other vias: 91.44,17.78
N$392  (via drill 0.9)
  other vias: 91.44,15.24
N$393  (via drill 0.9)
  other vias: 91.44,12.7
N$396  (via drill 0.9)
  other vias: 93.98,12.7
N$397  (via drill 0.9)
  other vias: 93.98,15.24
N$398  (via drill 0.9)
  other vias: 93.98,17.78
N$399  (via drill 0.9)
  other vias: 93.98,20.32
N$400  (via drill 0.9)
  other vias: 93.98,22.86
N$401  (via drill 0.9)
  other vias: 96.52,22.86
N$402  (via drill 0.9)
  other vias: 96.52,20.32
N$403  (via drill 0.9)
  other vias: 96.52,17.78
N$404  (via drill 0.9)
  other vias: 96.52,15.24
N$405  (via drill 0.9)
  other vias: 96.52,12.7
N$410  (via drill 0.9)
  other vias: 55.88,7.62
N$411  (via drill 0.9)
  other vias: 55.88,5.08
N$412  (via drill 0.9)
  other vias: 55.88,2.54
N$413  (via drill 0.9)
  other vias: 58.42,2.54
N$414  (via drill 0.9)
  other vias: 58.42,5.08
N$415  (via drill 0.9)
  other vias: 58.42,7.62
N$416  (via drill 0.9)
  other vias: 60.96,7.62
N$417  (via drill 0.9)
  other vias: 60.96,5.08
N$418  (via drill 0.9)
  other vias: 60.96,2.54
N$419  (via drill 0.9)
  other vias: 63.5,2.54
N$420  (via drill 0.9)
  other vias: 63.5,5.08
N$421  (via drill 0.9)
  other vias: 63.5,7.62
N$422  (via drill 0.9)
  other vias: 66.04,7.62
N$423  (via drill 0.9)
  other vias: 66.04,5.08
N$424  (via drill 0.9)
  other vias: 66.04,2.54
N$425  (via drill 0.9)
  other vias: 68.58,2.54
N$426  (via drill 0.9)
  other vias: 68.58,5.08
N$427  (via drill 0.9)
  other vias: 68.58,7.62
N$428  (via drill 0.9)
  other vias: 71.12,7.62
N$429  (via drill 0.9)
  other vias: 71.12,5.08
N$430  (via drill 0.9)
  other vias: 71.12,2.54
N$431  (via drill 0.9)
  other vias: 73.66,2.54
N$432  (via drill 0.9)
  other vias: 73.66,5.08
N$433  (via drill 0.9)
  other vias: 73.66,7.62
N$434  (via drill 0.9)
  other vias: 76.2,7.62
N$435  (via drill 0.9)
  other vias: 76.2,5.08
N$436  (via drill 0.9)
  other vias: 76.2,2.54
N$437  (via drill 0.9)
  other vias: 78.74,2.54
N$438  (via drill 0.9)
  other vias: 78.74,5.08
N$439  (via drill 0.9)
  other vias: 78.74,7.62
N$440  (via drill 0.9)
  other vias: 81.28,7.62
N$441  (via drill 0.9)
  other vias: 81.28,5.08
N$442  (via drill 0.9)
  other vias: 81.28,2.54
N$443  (via drill 0.9)
  other vias: 83.82,2.54
N$444  (via drill 0.9)
  other vias: 83.82,5.08
N$445  (via drill 0.9)
  other vias: 83.82,7.62
N$446  (via drill 0.9)
  other vias: 86.36,7.62
N$447  (via drill 0.9)
  other vias: 86.36,5.08
N$448  (via drill 0.9)
  other vias: 86.36,2.54
N$449  (via drill 0.9)
  other vias: 88.9,2.54
N$450  (via drill 0.9)
  other vias: 88.9,5.08
N$451  (via drill 0.9)
  other vias: 88.9,7.62
VCC  (via drill 0.35)
  Top 0.254: IC2.16 21.63,70.5 v21.89,70.5 | v32,70.5 32.57,69.93 IC3.16 33.63,70.5 v34,70.5 | v45,70.5 45.57,69.93 IC4.16 48.05,69.44 v49,68.5 | v62,70.5 62,70.02 IC5.16 62.63,69.5 v64.5,69.5 | v74.5,70.5 74.5,69.52 IC6.16 76.94,69.44 v77,69.5 | v87.5,70.5 87.5,69.52 IC7.16
  Bottom 0.254: v21.89,70.5 30.14,70.5 30.25,70.39 30.75,70.39 30.86,70.5 v32,70.5 | v34,70.5 v45,70.5 | v49,68.5 60,68.5 v62,70.5 | v64.5,69.5 73.5,69.5 v74.5,70.5 | v77,69.5 86.5,69.5 v87.5,70.5

### Text on the board
tPlace: A | B | Data_A | Clock_B | Latch_A | Data_B | Latch_B | GND | ADMITTANSEN Flipdot driver / August Hultman / Nils Hallkvist / 2017 | 5V | Clock_A | 5V | 24V